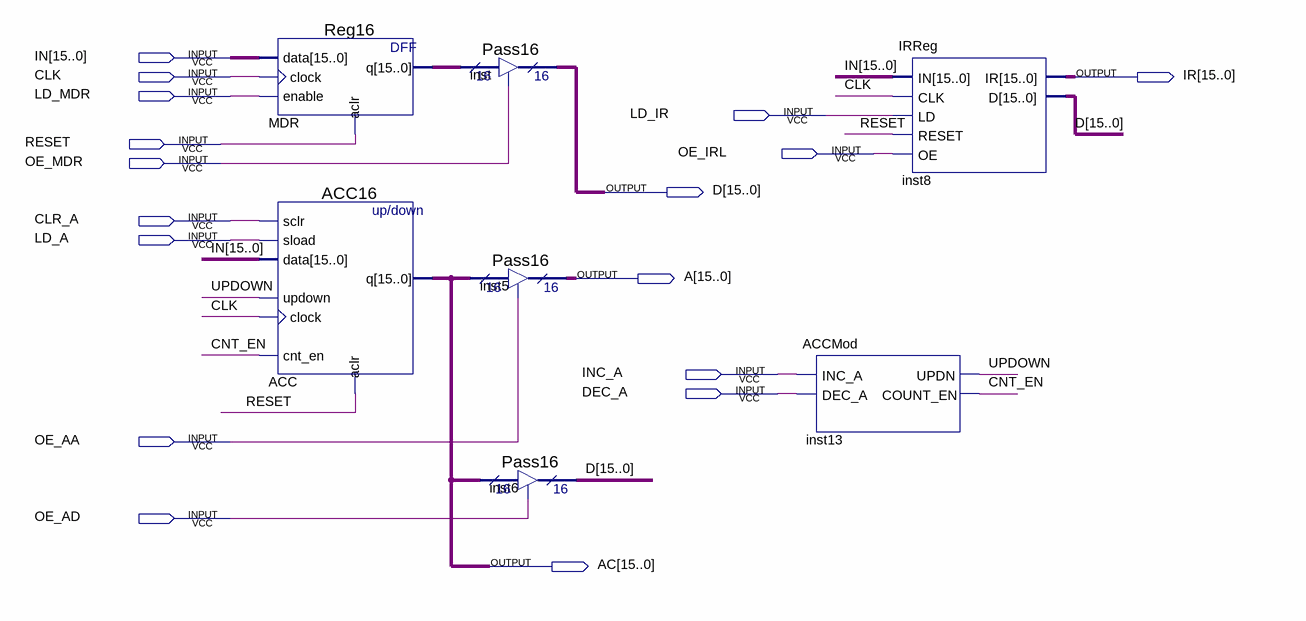
[diagram p0: schematic sheet]
// Quartus schematic DataRegs.bdf as structural Verilog: 7 symbols, 17 pins
module DataRegs (
  input  [15:0] IN,
  input  CLK,
  input  LD_MDR,
  input  LD_IR,
  input  RESET,
  input  OE_IRL,
  input  OE_MDR,
  input  CLR_A,
  input  LD_A,
  input  INC_A,
  input  DEC_A,
  input  OE_AA,
  input  OE_AD,
  output [15:0] IR,
  output [15:0] D,
  output [15:0] A,
  output [15:0] AC
);

  wire CNT_EN, UPDOWN;
  wire [15:0] MDR_q;

  Reg16 MDR (.data(IN), .clock(CLK), .enable(LD_MDR), .aclr(RESET), .q(MDR_q));
  ACC16 ACC (
    .sclr(CLR_A), .sload(LD_A), .data(IN), .updown(UPDOWN), .clock(CLK), .cnt_en(CNT_EN), .aclr(RESET), .q(AC));
  Pass16 inst (.enabledt(OE_MDR), .data(MDR_q), .tridata(D));
  Pass16 inst5 (.enabledt(OE_AA), .data(AC), .tridata(A));
  Pass16 inst6 (.enabledt(OE_AD), .data(AC), .tridata(D));
  ACCMod inst13 (.INC_A(INC_A), .DEC_A(DEC_A), .UPDN(UPDOWN), .COUNT_EN(CNT_EN));
  IRReg inst8 (.IN(IN), .CLK(CLK), .LD(LD_IR), .RESET(RESET), .OE(OE_IRL), .IR(IR), .D(D));
endmodule
